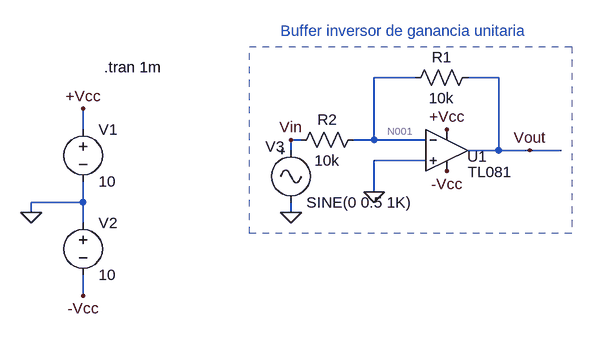
[diagram p0: schematic Buffer inversor.asc]
* Buffer inversor.asc
* U1: TL081 (symbol AutoGenerated\TL081 not available, pins judged from their places): In+=0 In-=N001 V+=+Vcc V-=-Vcc OUT=Vout
V1 +Vcc 0 10
V2 0 -Vcc 10
V3 Vin 0 SINE(0 0.5 1K)
R1 Vout N001 10k
R2 N001 Vin 10k
.tran 1m
* Buffer inversor de ganancia unitaria
.backanno
.end

* Results of the author's LTspice run, read from the files saved beside the schematic
* Operating Point, zero values left out:
*   V(vout) = 22.34 µV
*   V(-vcc) = -10 V
*   V(+vcc) = 10 V
*   V(n001) = 10.97 µV
*   I(R1) = 1.137 nA
*   I(R2) = 1.097 nA
*   I(V1) = -9.528 mA
*   I(V2) = -9.528 mA
*   I(V3) = 1.097 nA
*   Ix(u1:1) = 40.05 pA
*   Ix(u1:2) = 40.05 pA
*   Ix(u1:3) = 9.528 mA
*   Ix(u1:4) = -9.528 mA
*   Ix(u1:5) = -1.137 nA
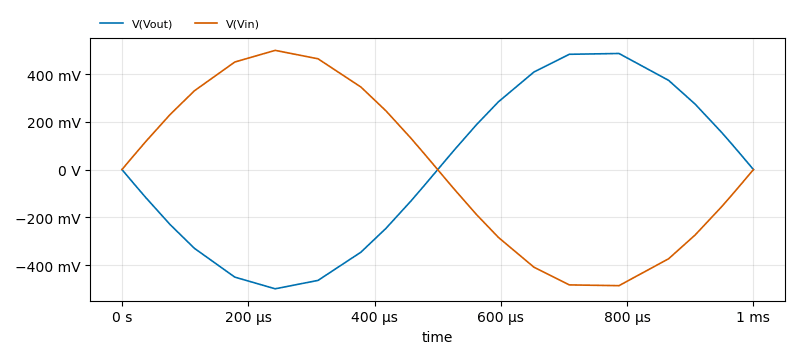
[diagram p1: Transient Analysis of Buffer inversor.asc, plotted from the saved traces]
* Transient Analysis, 1 run:
*   V(Vout): min -499.4 mV, max 486.4 mV, average -257.4 µV, rms 350.5 mV, last 316.8 µV
*   V(Vin): min -486.3 mV, max 499.5 mV, average 279.7 µV, rms 350.6 mV, last 0 V